# Altium schematic sheet 35、基于STM32单片机智能手环心率计步器体温显示设计.SchDoc
size A4
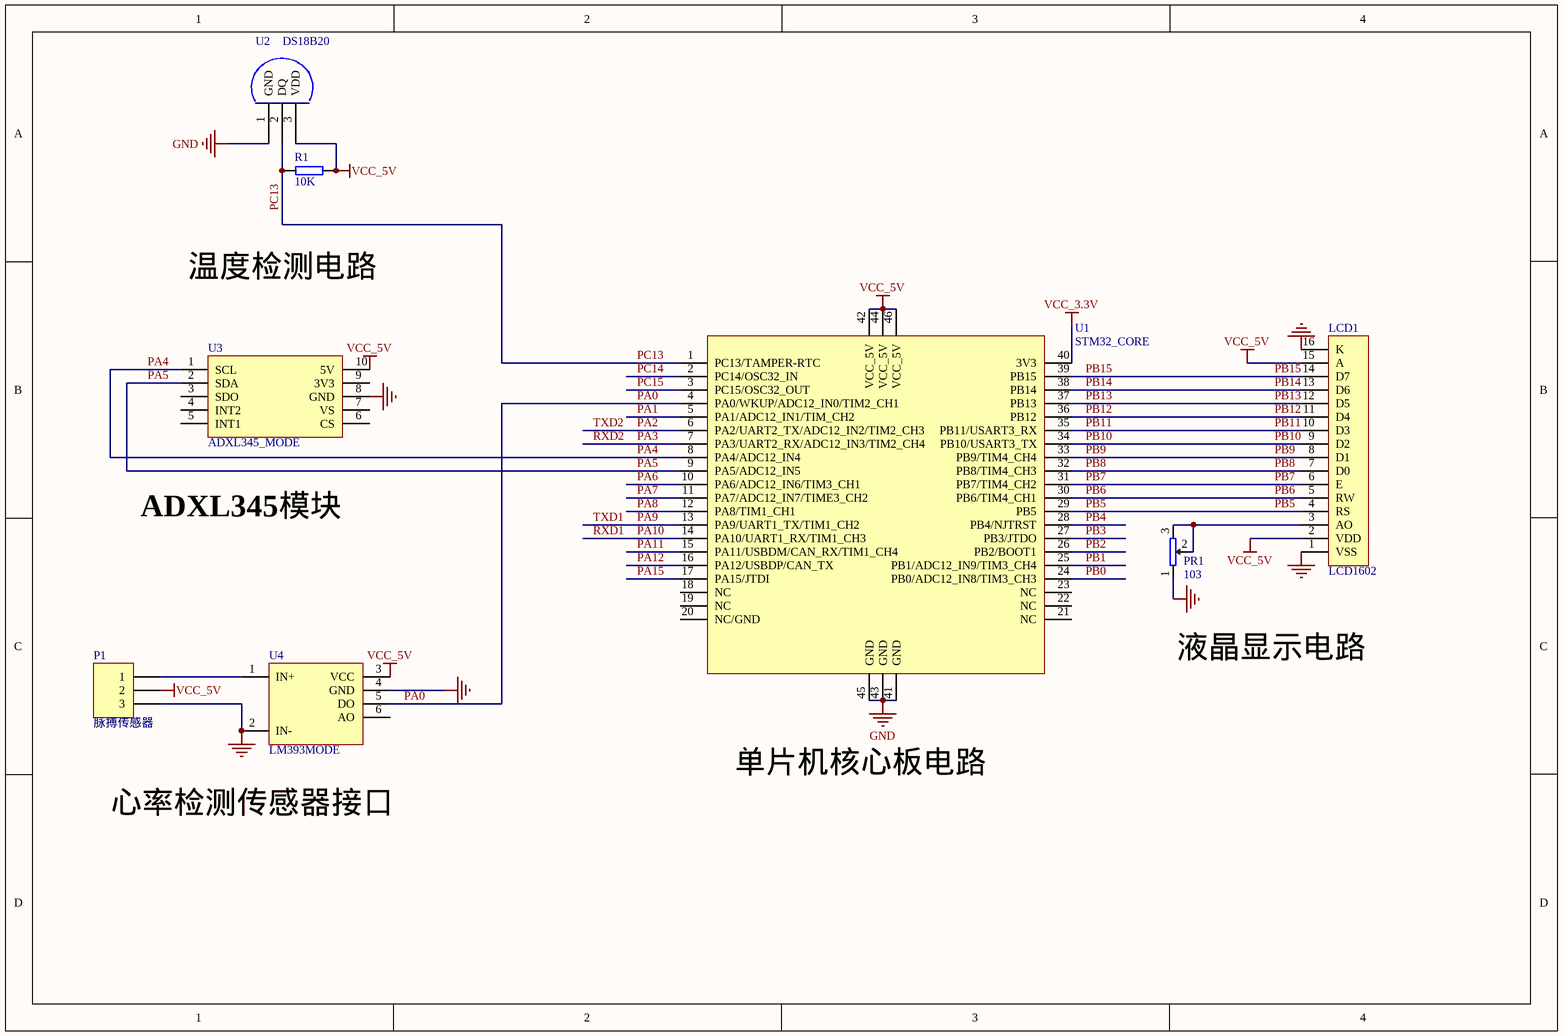
[diagram p0: 35、基于STM32单片机智能手环心率计步器体温显示设计.SchDoc]

## Parts
LCD1  LCD1602  [LCD1602]
P1  脉搏传感器  [心率MODE]
PR1  103  [WH06-2]
R1  10K  [AXIAL0.3]
U1  STM32_CORE  [STM32_CORE]
U2  DS18B20  [TO-92]
U3  ADXL345_MODE  [ADXL345MODE]
U4  LM393MODE  [LM393MODE]

## Nets
GND: LCD1.1(VSS) LCD1.16(K) P1.3 PR1.1 U1.41(GND) U1.43(GND) U1.45(GND) U2.1(GND) U3.8(GND) U4.2(IN-) U4.4(GND)
VCC_3.3V: U1.40(3V3)
VCC_5V: LCD1.2(VDD) LCD1.15(A) P1.2 R1.2 U1.42(VCC_5V) U1.44(VCC_5V) U1.46(VCC_5V) U2.3(VDD) U3.10(5V) U4.3(VCC)
PA0: U1.4(PA0/WKUP/ADC12_IN0/TIM2_CH1) U4.5(DO)
PA1: U1.5(PA1/ADC12_IN1/TIM_CH2)
PA2: U1.6(PA2/UART2_TX/ADC12_IN2/TIM2_CH3)  [also labelled TXD2]
PA3: U1.7(PA3/UART2_RX/ADC12_IN3/TIM2_CH4)  [also labelled RXD2]
PA4: U1.8(PA4/ADC12_IN4) U3.1(SCL)
PA5: U1.9(PA5/ADC12_IN5) U3.2(SDA)
PA6: U1.10(PA6/ADC12_IN6/TIM3_CH1)
PA7: U1.11(PA7/ADC12_IN7/TIME3_CH2)
PA8: U1.12(PA8/TIM1_CH1)
PA9: U1.13(PA9/UART1_TX/TIM1_CH2)  [also labelled TXD1]
PA10: U1.14(PA10/UART1_RX/TIM1_CH3)  [also labelled RXD1]
PA11: U1.15(PA11/USBDM/CAN_RX/TIM1_CH4)
PA12: U1.16(PA12/USBDP/CAN_TX)
PA15: U1.17(PA15/JTDI)
PB0: U1.24(PB0/ADC12_IN8/TIM3_CH3)
PB1: U1.25(PB1/ADC12_IN9/TIM3_CH4)
PB2: U1.26(PB2/BOOT1)
PB3: U1.27(PB3/JTDO)
PB4: U1.28(PB4/NJTRST)
PB5: LCD1.4(RS) U1.29(PB5)
PB6: LCD1.5(RW) U1.30(PB6/TIM4_CH1)
PB7: LCD1.6(E) U1.31(PB7/TIM4_CH2)
PB8: LCD1.7(D0) U1.32(PB8/TIM4_CH3)
PB9: LCD1.8(D1) U1.33(PB9/TIM4_CH4)
PB10: LCD1.9(D2) U1.34(PB10/USART3_TX)
PB11: LCD1.10(D3) U1.35(PB11/USART3_RX)
PB12: LCD1.11(D4) U1.36(PB12)
PB13: LCD1.12(D5) U1.37(PB13)
PB14: LCD1.13(D6) U1.38(PB14)
PB15: LCD1.14(D7) U1.39(PB15)
PC13: R1.1 U1.1(PC13/TAMPER-RTC) U2.2(DQ)
PC14: U1.2(PC14/OSC32_IN)
PC15: U1.3(PC15/OSC32_OUT)
NetLCD1_3: LCD1.3(AO) PR1.2 PR1.3
NetP1_1: P1.1 U4.1(IN+)

Not connected (* = marked no-connect by the designer): U1 18(NC) 19(NC) 20(NC/GND) 21(NC) 22(NC) 23(NC); U3 3(SDO) 4(INT2) 5(INT1) 6(CS) 7(VS) 9(3V3); U4 6(AO)

## Notes on the sheet
- 温度检测电路
- ADXL345模块
- 液晶显示电路
- 单片机核心板电路
- 心率检测传感器接口

## Library data of the parts
LCD1 = LCD1602: LCD1602液晶
PR1 = PR: 电位器
R1 = RES: 电阻
U1 = STM32_CORE: STM32核心板
U2 = DS18B20: DS18B20温度芯片
U3 = ADXL345_MODE: ADXL345 倾斜模块
U4 = LM393MODE: LM393比较器芯片
P1 = 脉搏传感器: LatestRevisionDate: 17-Jul-2002; LatestRevisionNote: Re-released for DXP Platform.; Publisher: Altium Limited